# Altium schematic sheet SPINE_CONNECTOR.SchDoc
size Letter; SheetNumber: 1; SheetTotal: 5
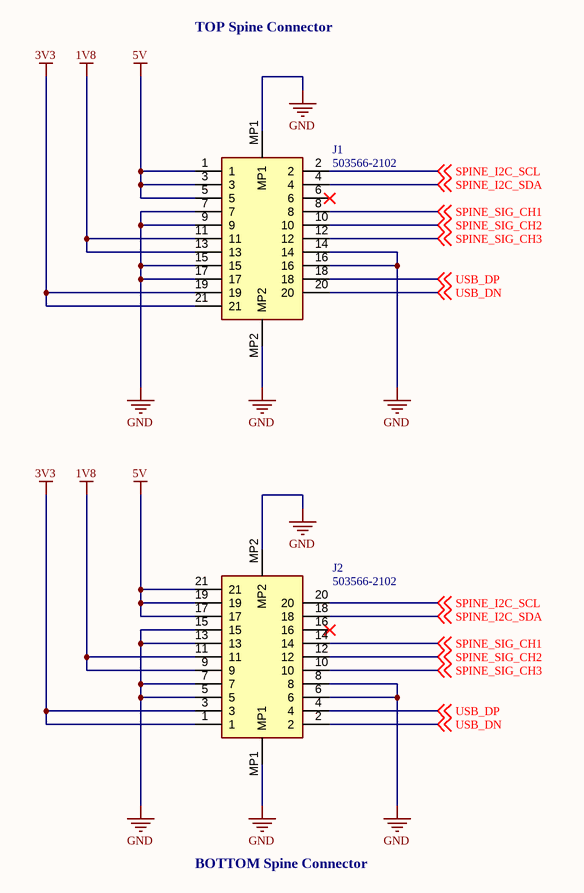
[diagram p0: SPINE_CONNECTOR.SchDoc]

## Parts
J1  503566-2102  [5035662102]
J2  503566-2102  [5035662102]

## Nets
1V8: J1.11 J1.13 J2.9 J2.11
3V3: J1.19 J1.21 J2.1 J2.3
5V: J1.1 J1.3 J1.5 J2.17 J2.19 J2.21
GND: J1.7 J1.9 J1.14 J1.15 J1.16 J1.17 J1.MP1 J1.MP2 J2.5 J2.6 J2.7 J2.8 J2.13 J2.15 J2.MP1 J2.MP2
SPINE_I2C_SCL: J1.2 J2.20 ; off-sheet SPINE_I2C_SCL
SPINE_I2C_SDA: J1.4 J2.18 ; off-sheet SPINE_I2C_SDA
SPINE_SIG_CH1: J1.8 J2.14 ; off-sheet SPINE_SIG_CH1
SPINE_SIG_CH2: J1.10 J2.12 ; off-sheet SPINE_SIG_CH2
SPINE_SIG_CH3: J1.12 J2.10 ; off-sheet SPINE_SIG_CH3
USB_DN: J1.20 J2.2 ; off-sheet USB_DN
USB_DP: J1.18 J2.4 ; off-sheet USB_DP

Not connected (* = marked no-connect by the designer): J1 6*; J2 16*

## Notes on the sheet
- TOP Spine Connector
- BOTTOM Spine Connector
- Title
- Copyright (c) Meta Platforms, Inc. and affiliates.
  All rights reserved.
  This source code is licensed under the license found in the
  LICENSE file in the root directory of this source tree.
- Sheet
- of

## Library data of the parts
J1 J2 = 503566-2102: Connector; Manufacturer_Name: Molex; Datasheet Link: https://www.molex.com/pdm_docs/sd/5035662102_sd.pdf; Height: 1.69mm; Manufacturer_Part_Number: 503566-2102; Mouser Part Number: 538-503566-2102; Mouser Price/Stock: https://www.mouser.co.uk/ProductDetail/Molex/503566-2102?qs=0lSvoLzn4L8%252Bw2FHrppS3g%3D%3D